# EAGLE design With GPS (EAGLE 9.6.2)
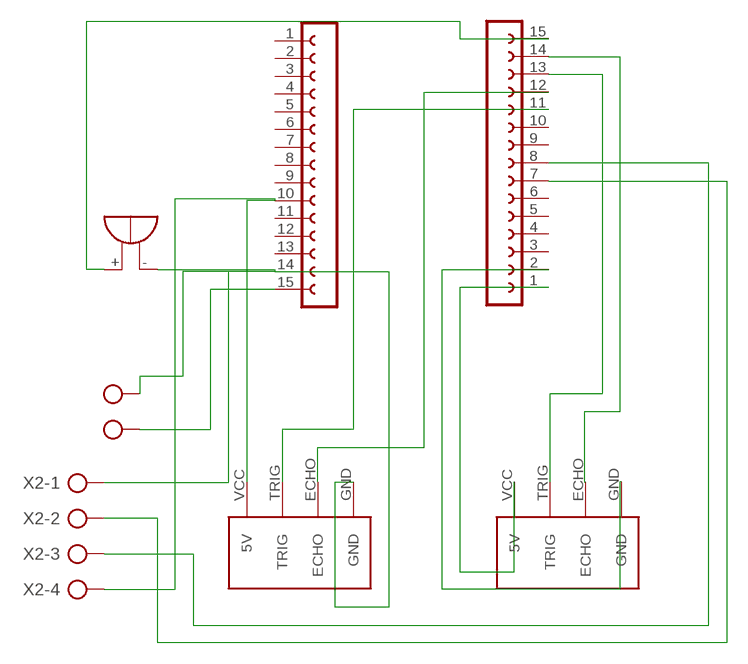
[diagram p0: schematic, sheet 1]

## Parts
J_ULTRASONIC_3  HC-SR04  [HC-SR04_FOOTPRINT]
J_ULTRASONIC_4  HC-SR04  [HC-SR04_FOOTPRINT]
SG2  EB2505  [EB2505]
SV1  FE15-1  [FE15]
SV2  FE15-1  [FE15]
X1  AK500/2-H  [AK500/2-H]
X2  AK300/4  [AK300/4]

## Nets
N$1: J_ULTRASONIC_3.ECHO SV1.14
N$2: J_ULTRASONIC_3.TRIG SV1.13
N$3: J_ULTRASONIC_3.GND SV1.2
N$4: J_ULTRASONIC_3.VCC(5V) SV1.1
N$6: SV2.15 X1.2
N$7: SG2.+ SV1.15
N$8: J_ULTRASONIC_4.ECHO SV1.12
N$9: J_ULTRASONIC_4.TRIG SV1.11
N$10: J_ULTRASONIC_4.VCC(5V) SV2.10 X2.4
N$11: SV1.8 X2.3
N$12: SV1.7 X2.2
N$13: J_ULTRASONIC_4.GND SG2.- SV2.14 X1.1 X2.1
Unconnected: SV1.3 SV1.4 SV1.5 SV1.6 SV1.9 SV1.10 SV2.1 SV2.2 SV2.3 SV2.4 SV2.5 SV2.6 SV2.7 SV2.8 SV2.9 SV2.11 SV2.12 SV2.13

## Library data of the parts
J_ULTRASONIC_3 J_ULTRASONIC_4 = Ultrasonic Sensor HC-SR04:HC-SR04: Ultrasonic Sensor HC-SR04
SG2 = buzzer:EB2505: BUZZER Source: Buerklin; OC_FARNELL: unknown; OC_NEWARK: unknown
SV1 SV2 = con-lsta:FE15-1: FEMALE HEADER; OC_FARNELL: unknown; OC_NEWARK: unknown
X1 = con-ptr500:AK500/2-H: CONNECTOR Aug. 2004 / PTR Meßtechnik: Die Bezeichnung der Serie AK505 wurde geändert. Es handelt sich hierbei um AK500 in horizontaler Ausführung.; OC_FARNELL: unknown; OC_NEWARK: unknown
X2 = con-ptr500:AK300/4: CONNECTOR; OC_FARNELL: unknown; OC_NEWARK: unknown

## Board
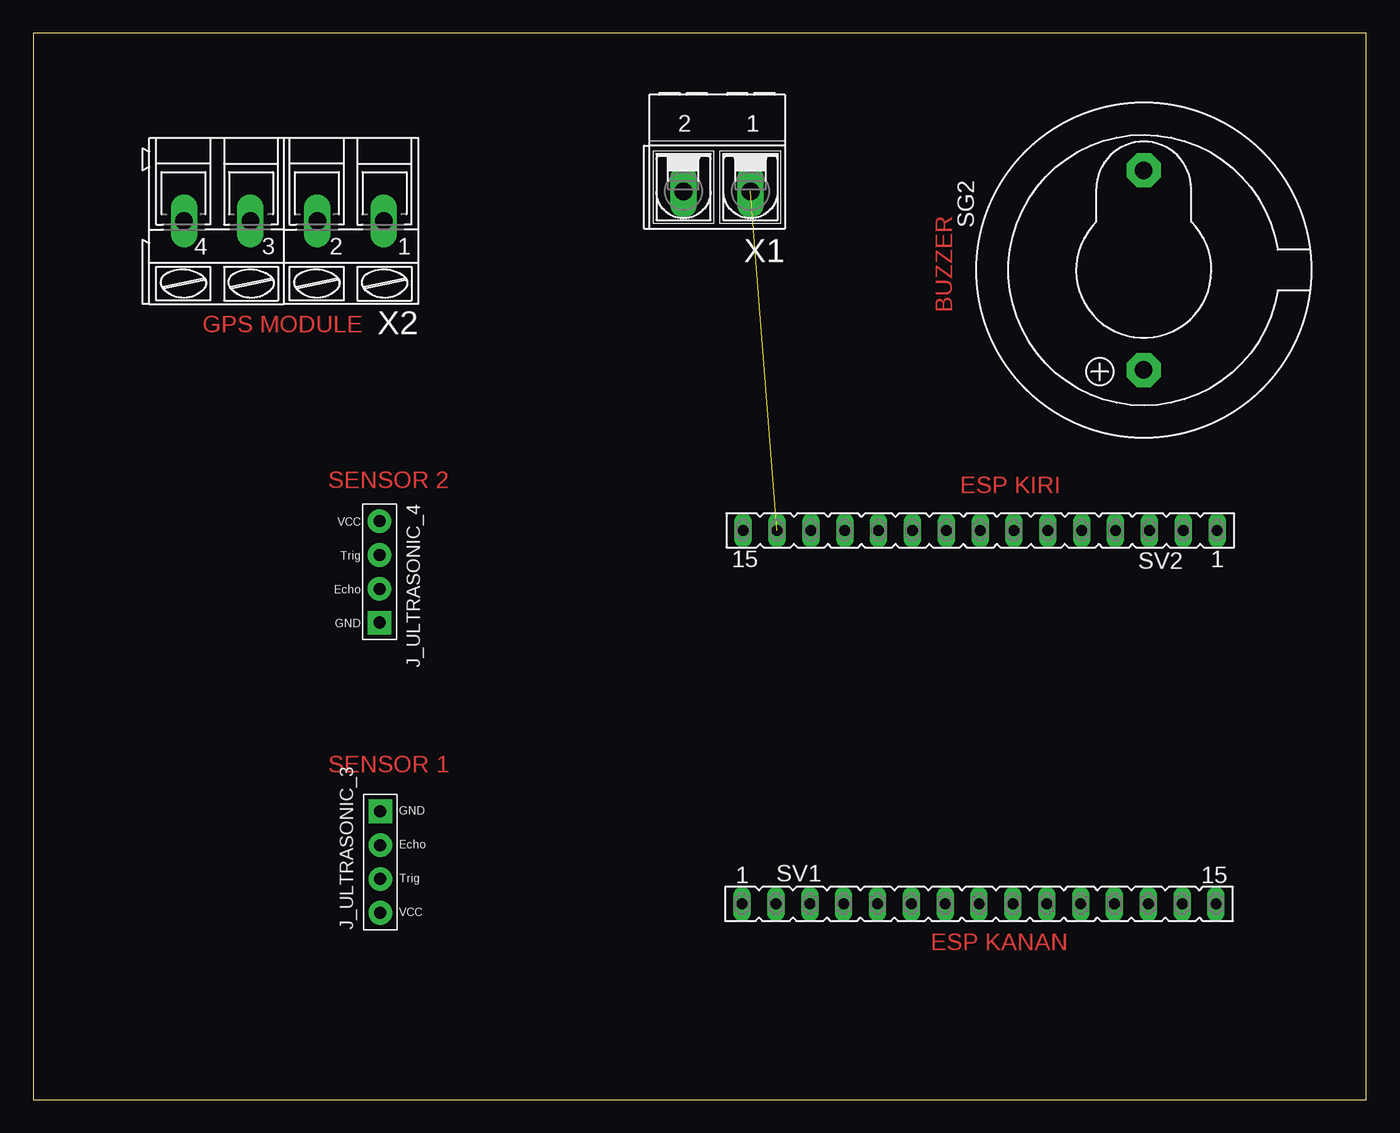
[diagram p1: board, top side]
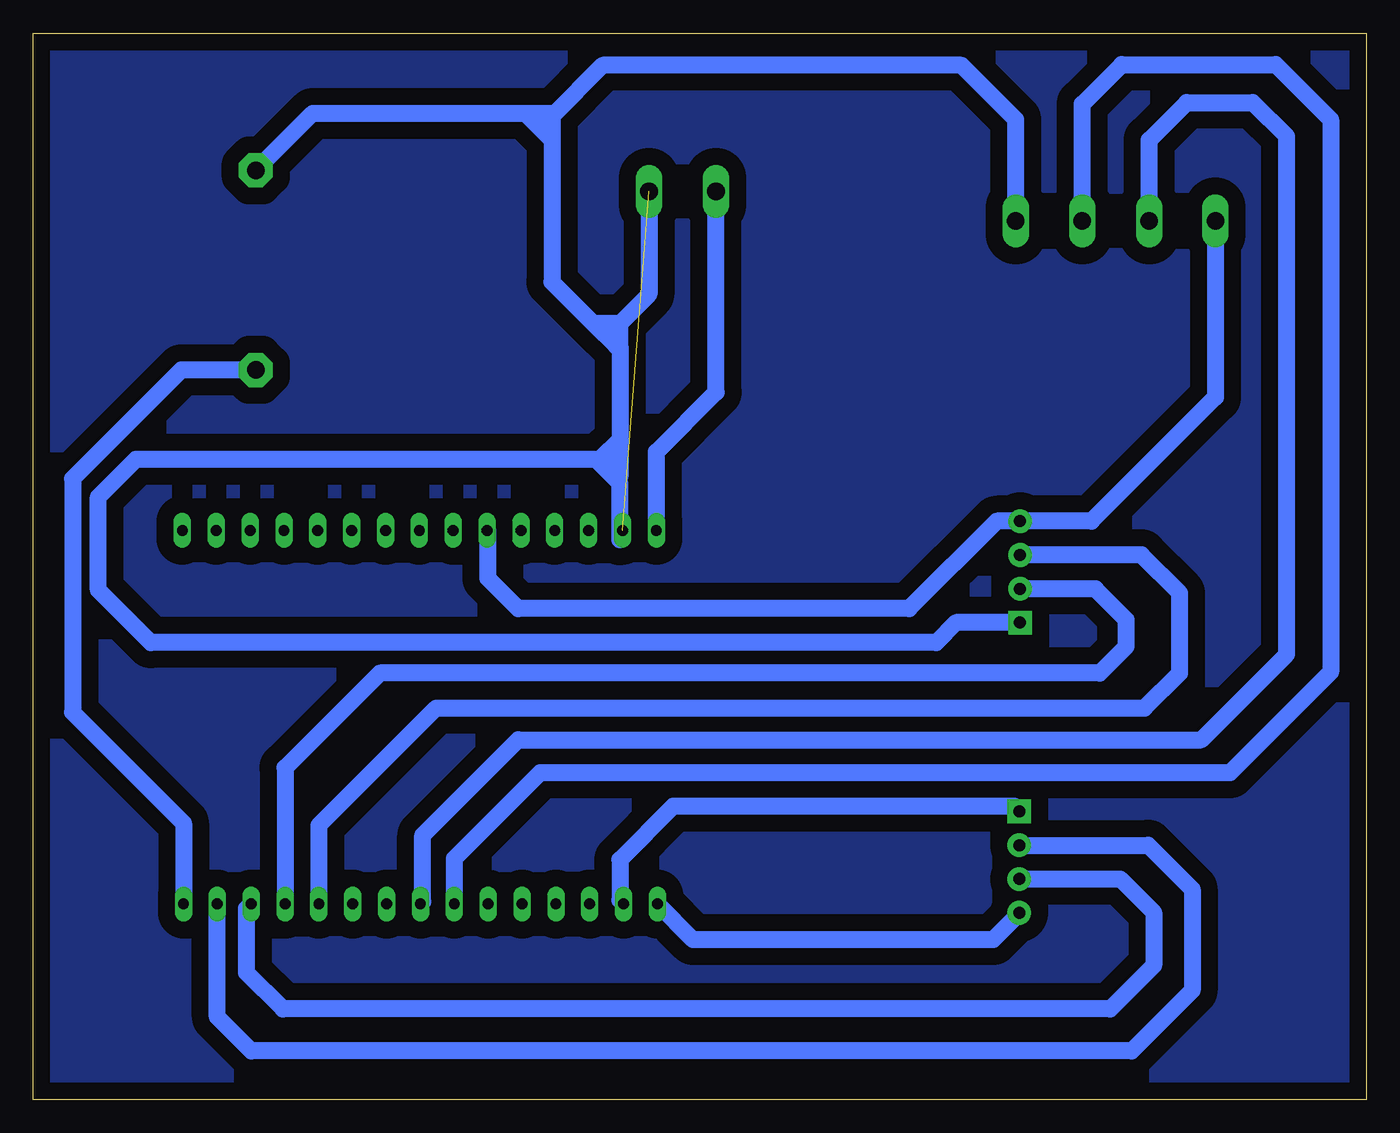
[diagram p2: board, bottom side, seen from below]

Size 100 x 80 mm. Coordinates in mm from the lower left corner, seen from the top.
Outline: 0,0 100,0 100,80 0,80 0,0
Copper layers (1*16): Top 0.035mm / dielectric 1.5mm / Bottom 0.035mm
Design rules "default *": minimum track width 40mil, minimum drill 0.35mm, track to track 50mil, track to pad 50mil, pad to pad 50mil, via to via 50mil, smd to smd 50mil, copper to edge 50mil, drill to drill 100mil, minimum pad ring 10mil, minimum via ring 8mil, stop-mask expansion 4mil, vias tented up to drill 0mil, thermal gap 10mil

### Footprints (pad centres in the part's own frame; a part is rotated, then mirrored left to right if it is on the bottom)
HC-SR04_FOOTPRINT = drill 0.9 pad 1.778: ECHO 0,1.27; TRIG 0,-1.27; VCC 0,-3.81 | drill 0.9 pad 1.778 square: GND 0,3.81
EB2505 = drill 1.321 pad 2.54 octagon: + -7.493,0; - 7.493,0
FE15 = drill 0.813 long: 1 -17.78,0; 2 -15.24,0; 3 -12.7,0; 4 -10.16,0; 5 -7.62,0; 6 -5.08,0; 7 -2.54,0; 8 0,0; 9 2.54,0; 10 5.08,0; 11 7.62,0; 12 10.16,0; 13 12.7,0; 14 15.24,0; 15 17.78,0
AK500/2-H = drill 1.321 long: 1 -2.515,0; 2 2.515,0
AK300/4 = drill 1.321 long: 1 -7.493,0; 2 -2.515,0; 3 2.515,0; 4 7.493,0

### Placement (x,y rotation side)
J_ULTRASONIC_3  26.04,17.81 0 top
J_ULTRASONIC_4  25.97,39.59 180 top
SG2  83.31,62.23 90 top
SV1  70.96,14.68 0 top
SV2  71.04,42.7 180 top
X1  51.3,68.15 180 top
X2  18.8,65.91 180 top

### Tracks (layer width: path | path; a pad name or v marks a point on that pad's centre or on a via)
1
  pour Bottom: 0,80 100,80 100,0 0,0
N$1
  Bottom 1.27: J_ULTRASONIC_3.ECHO 16.35,19.08 13.05,15.78 13.05,8.19 17.59,3.65 83.65,3.65 86.2,6.2 SV1.14
N$2
  Bottom 1.27: J_ULTRASONIC_3.TRIG 18.45,16.54 15.94,14.03 15.94,10.06 19.21,6.79 81.27,6.79 84,9.52 84,14.33 SV1.13
N$3
  Bottom 1.27: J_ULTRASONIC_3.GND 26.41,22 52,22 56,18 56,14.96 SV1.2
N$4
  Bottom 1.27: J_ULTRASONIC_3.VCC 26.04,13.96 28,12 50.5,12 SV1.1
N$6
  Bottom 1.27: SV2.15 53.26,48.6 48.78,53.07 X1.2
N$7
  Bottom 0.813: SV1.15 88.79,14.73
  Bottom 1.27: SG2.+ 88.9,54.74 97.05,46.59 97.05,29.05 88.74,20.74 SV1.15
N$8
  Bottom 1.27: SV1.12 81.12,24.88 74,32 20,32 18,34 18,36 20.32,38.32 J_ULTRASONIC_4.ECHO
N$9
  Bottom 1.27: SV1.11 78.58,20.57 69.78,29.36 16.64,29.36 14,32 14,38 16.86,40.86 J_ULTRASONIC_4.TRIG
N$10
  Bottom 1.27: X2.4 11.3,52.7 20.6,43.4 J_ULTRASONIC_4.VCC 27.72,43.4 34.29,36.83 63.63,36.83 65.91,39.12 65.91,42.66 SV2.10
N$11
  Bottom 1.27: SV1.8 70.78,14.86 70.78,19.83 63.62,26.98 12.38,26.98 5.97,33.4 5.97,72.26 8.51,74.8 13.46,74.8 16.28,71.98 X2.3
N$12
  Bottom 1.27: X2.2 21.31,74.69 18.35,77.65 6.79,77.65 2.67,73.53 2.67,32.06 10.22,24.51 61.98,24.51 68.42,18.07 SV1.7
N$13  (1 unrouted)
  Bottom 1.27: X2.1 26.29,73.53 30.35,77.6 57.28,77.6 61.09,73.79 | SG2.- 79.03,74 63.11,74 | 56,42.9 SV2.14 | 56,42 56,42.9 | X1.1 53.81,60.41 56,58.21 | 56,42.9 56,46.23 57.82,48.05 92.28,48.05 95.12,45.21 95.12,38.23 91.19,34.29 32.26,34.29 30.77,35.78 J_ULTRASONIC_4.GND | 56,56.52 56,49.53 | 56,49.53 56,46.74 57.4,48.13 56,49.53 | 56,56.52 56,58.21 | 61.09,71.98 61.09,61.34 57.96,58.21 | 61.09,71.98 63.11,74 | 56,58.21 57.96,58.21 | 57.96,58.21 56.26,56.52 56,56.52 | 61.09,73.79 61.09,71.98 | 63.11,74 61.3,74 61.09,73.79

### Text on the board
Top: BUZZER | GPS MODULE | ESP KIRI | SENSOR 2 | SENSOR 1 | ESP KANAN